# EAGLE schematic v3r01-carb-sync-shield (EAGLE 7.2.0)
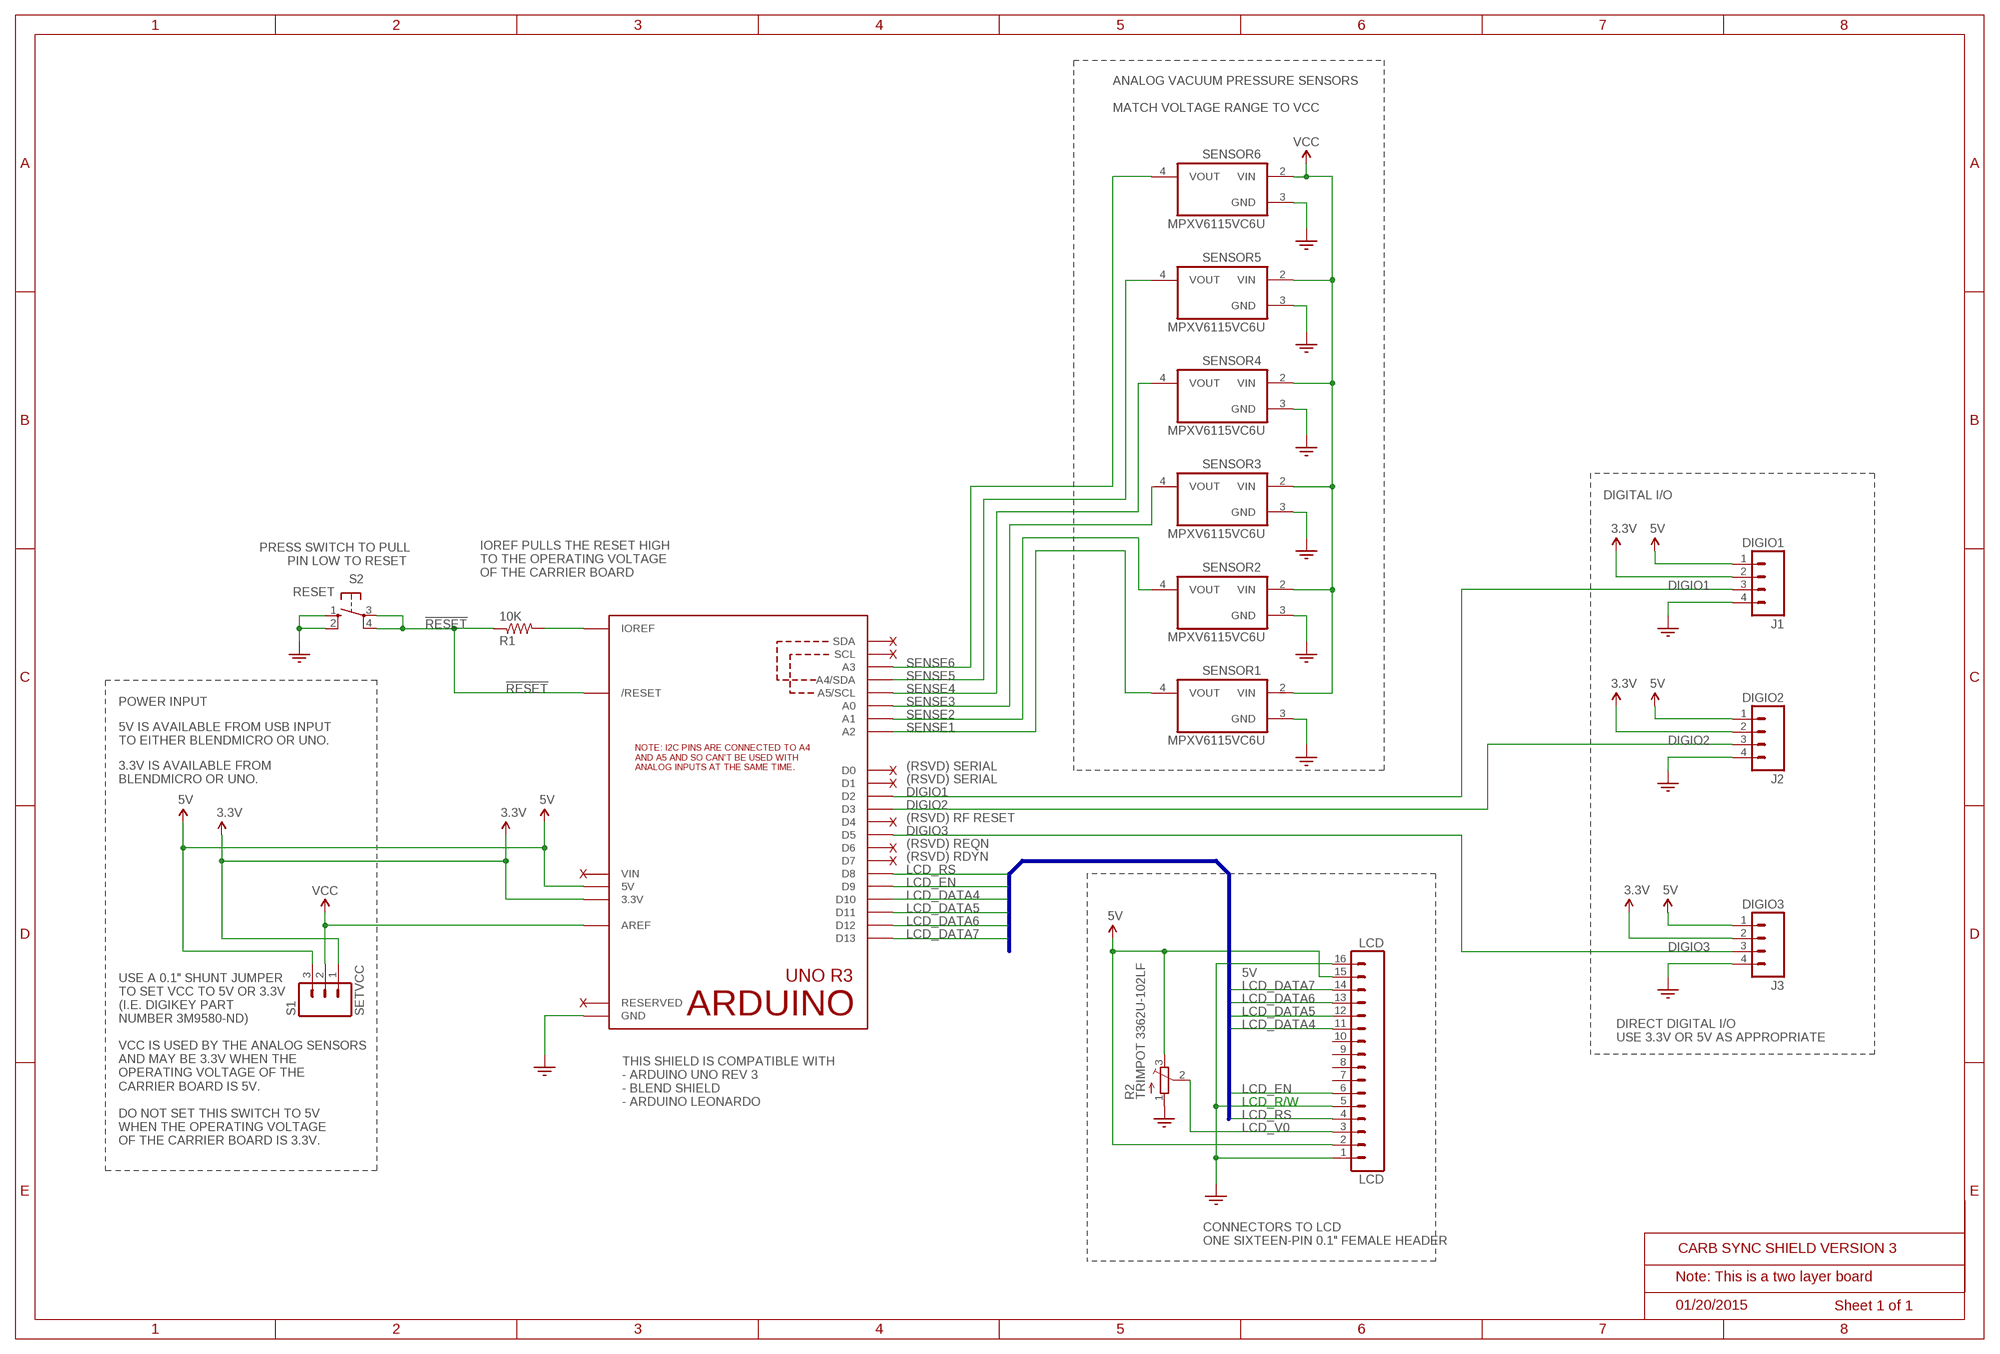
[diagram p0: schematic, sheet 1]

## Parts
J1  DIGIO1  M04LONGPADS  [1X04_LONGPADS]
J2  DIGIO2  M04LONGPADS  [1X04_LONGPADS]
J3  DIGIO3  M04LONGPADS  [1X04_LONGPADS]
LCD  LCD  CARBSYNCSHIELD_LCD  [CARBSYNCSHIELD_LCD]
R1  10K  R-US_0411/12  [0411/12]
R2  TRIMPOT 3362U-102LF  TRIMPOT3386  [TRIM-3386]
S1  SETVCC  M03LONGPADS  [1X03_LONGPADS]
S2  RESET  10-XX  [B3F-10XX]
SENSOR1  MPXV6115VC6U  [MPXV6115VC6U/T1-CASE482A]
SENSOR2  MPXV6115VC6U  [MPXV6115VC6U/T1-CASE482A]
SENSOR3  MPXV6115VC6U  [MPXV6115VC6U/T1-CASE482A]
SENSOR4  MPXV6115VC6U  [MPXV6115VC6U/T1-CASE482A]
SENSOR5  MPXV6115VC6U  [MPXV6115VC6U/T1-CASE482A]
SENSOR6  MPXV6115VC6U  [MPXV6115VC6U/T1-CASE482A]
U$13  ARDUINO-UNO-R3  [ARDUINO-UNO-R3-HOLES-NODIM]

## Nets
3.3V: J1.2 J2.2 J3.2 S1.1 U$13.3V(3.3V)
5V: J1.1 J2.1 J3.1 LCD.2 LCD.15 R2.3(E) S1.3 U$13.5V
!RESET: R1.1 S2.3(P) S2.4(P1) U$13.RESET(/RESET)
DIGIO1: J1.3 U$13.D2
DIGIO2: J2.3 U$13.D3
DIGIO3: J3.3 U$13.D5
GND: J1.4 J2.4 J3.4 LCD.1 LCD.5 LCD.16 R2.1(A) S2.1(S) S2.2(S1) SENSOR1.3(GND) SENSOR2.3(GND) SENSOR3.3(GND) SENSOR4.3(GND) SENSOR5.3(GND) SENSOR6.3(GND) U$13.GND U$13.GND1(GND) U$13.GND2(GND)
IOREF: R1.2 U$13.IOREF
LCD_DATA4: LCD.11 U$13.D10
LCD_DATA5: LCD.12 U$13.D11
LCD_DATA6: LCD.13 U$13.D12
LCD_DATA7: LCD.14 U$13.D13
LCD_EN: LCD.6 U$13.D9
LCD_RS: LCD.4 U$13.D8
LCD_V0: LCD.3 R2.2(S)
SENSE1: SENSOR1.4(VOUT) U$13.A2
SENSE2: SENSOR2.4(VOUT) U$13.A1
SENSE3: SENSOR3.4(VOUT) U$13.A0
SENSE4: SENSOR4.4(VOUT) U$13.A5(A5/SCL)
SENSE5: SENSOR5.4(VOUT) U$13.A4(A4/SDA)
SENSE6: SENSOR6.4(VOUT) U$13.A3
VCC: S1.2 SENSOR1.2(VIN) SENSOR2.2(VIN) SENSOR3.2(VIN) SENSOR4.2(VIN) SENSOR5.2(VIN) SENSOR6.2(VIN) U$13.AREF
Unconnected: LCD.7 LCD.8 LCD.9 LCD.10 U$13.D0 U$13.D1 U$13.D4 U$13.D6 U$13.D7 U$13.RESERVED U$13.SCL U$13.SDA

## Buses
LCD_RS,LCD_EN,LCD_DATA4,LCD_DATA5,LCD_DATA6,LCD_DATA7

## Notes on the sheet
- ANALOG VACUUM PRESSURE SENSORS
  
  MATCH VOLTAGE RANGE TO VCC
- DIGITAL I/O
- PRESS SWITCH TO PULL
  PIN LOW TO RESET
- IOREF PULLS THE RESET HIGH
  TO THE OPERATING VOLTAGE
  OF THE CARRIER BOARD
- X
- X
- POWER INPUT
- 5V IS AVAILABLE FROM USB INPUT
  TO EITHER BLENDMICRO OR UNO.
- X | (RSVD) SERIAL
- 3.3V IS AVAILABLE FROM 
  BLENDMICRO OR UNO.
- X | (RSVD) SERIAL
- X | (RSVD) RF RESET
- X | (RSVD) REQN
- X | (RSVD) RDYN
- X
- X
- DIRECT DIGITAL I/O 
  USE 3.3V OR 5V AS APPROPRIATE
- THIS SHIELD IS COMPATIBLE WITH
  - ARDUINO UNO REV 3
  - BLEND SHIELD
  - ARDUINO LEONARDO
- LCD_R/W
- USE A 0.1" SHUNT JUMPER 
  TO SET VCC TO 5V OR 3.3V
  (I.E. DIGIKEY PART 
  NUMBER 3M9580-ND)
  
  VCC IS USED BY THE ANALOG SENSORS
  AND MAY BE 3.3V WHEN THE 
  OPERATING VOLTAGE OF THE
  CARRIER BOARD IS 5V.
  
  DO NOT SET THIS SWITCH TO 5V
  WHEN THE OPERATING VOLTAGE
  OF THE CARRIER BOARD IS 3.3V.
- CONNECTORS TO LCD
  ONE SIXTEEN-PIN 0.1" FEMALE HEADER
- CARB SYNC SHIELD VERSION 3
- Note: This is a two layer board
- 01/20/2015 | Sheet 1 of 1

## Power pins joined to a net without a drawn wire
VIN: U$13.VIN

## Library data of the parts
J1-J3 = SparkFun-Connectors:M04: Header 4 Standard 4-pin 0.1" header. Use with straight break away headers (SKU : PRT-00116), right angle break away headers (PRT-00553), swiss pins (PRT-00743), machine pins (PRT-00117), and female headers (PRT-00115). Molex polarized connector foot print use with SKU : PRT-08231 with associated crimp pins and housings. 1MM SMD Version SKU: PRT-10208
LCD = v2-carb-sync-shield:CARBSYNCSHIELD_LCD
R1 = adafruit:R-US_: RESISTOR, American symbol
R2 = adafruit:TRIMPOT: SMT trimmer potentiometer part number TC33X http://www.ladyada.net/library/eagle
S1 = SparkFun-Connectors:M03: Header 3 Standard 3-pin 0.1" header. Use with straight break away headers (SKU : PRT-00116), right angle break away headers (PRT-00553), swiss pins (PRT-00743), machine pins (PRT-00117), and female headers (PRT-00115). Molex polarized connector foot print use with SKU : PRT-08232 with associated crimp pins and housings.
S2 = switch-omron:10-XX: OMRON SWITCH; MPN: B3F-1000; OC_FARNELL: 176432; OC_NEWARK: 36M3542
SENSOR1-SENSOR6 = carbsyncshield:MPXV6115VC6U
U$13 = carbsyncshield:ARDUINO-UNO-R3